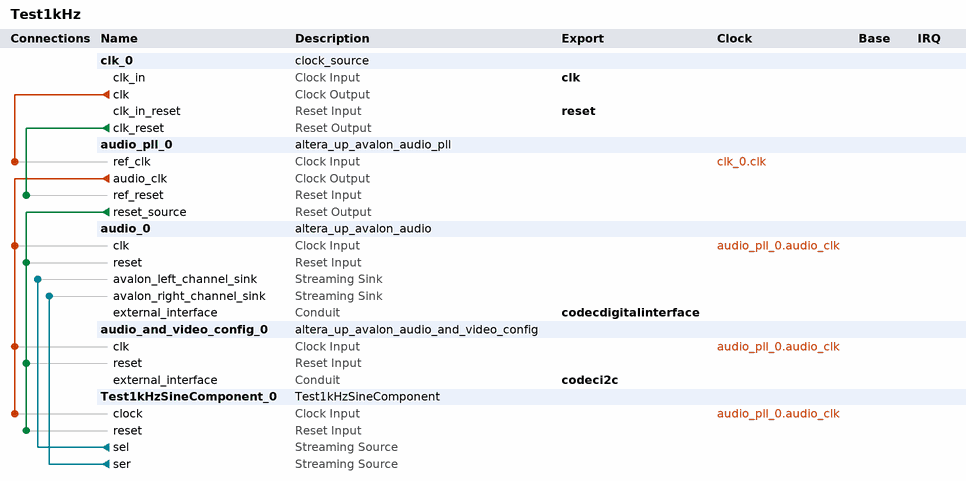
[diagram p0: system contents]
# Platform Designer (Qsys) system Test1kHz, Cyclone V 5CSEMA5F31C6
# Parameters at their usual value, and those the tool derives, are not listed.
package require -exact qsys 17.1
create_system Test1kHz
set_project_property DEVICE_FAMILY {Cyclone V}
set_project_property DEVICE 5CSEMA5F31C6

add_instance clk_0 clock_source 17.1
set_instance_parameter_value clk_0 clockFrequency 50000000

add_instance audio_pll_0 altera_up_avalon_audio_pll 17.1
set_instance_parameter_value audio_pll_0 gui_refclk 50.0

add_instance audio_0 altera_up_avalon_audio 17.1
set_instance_parameter_value audio_0 audio_in false
set_instance_parameter_value audio_0 avalon_bus_type Streaming
set_instance_parameter_value audio_0 dw 24

add_instance audio_and_video_config_0 altera_up_avalon_audio_and_video_config 17.1
set_instance_parameter_value audio_and_video_config_0 audio_in {Microphone to ADC}
set_instance_parameter_value audio_and_video_config_0 bit_length 24
set_instance_parameter_value audio_and_video_config_0 board DE1-SoC
set_instance_parameter_value audio_and_video_config_0 line_in_bypass false
set_instance_parameter_value audio_and_video_config_0 sampling_rate {48 kHz}

add_instance Test1kHzSineComponent_0 Test1kHzSineComponent 1.0
set_instance_parameter_value Test1kHzSineComponent_0 count_freq 48
set_instance_parameter_value Test1kHzSineComponent_0 count_samp 256

# connections
add_connection audio_pll_0.audio_clk audio_0.clk clock
add_connection audio_pll_0.audio_clk audio_and_video_config_0.clk clock
add_connection audio_pll_0.audio_clk Test1kHzSineComponent_0.clock clock
add_connection clk_0.clk audio_pll_0.ref_clk clock
add_connection audio_pll_0.reset_source audio_0.reset reset
add_connection audio_pll_0.reset_source audio_and_video_config_0.reset reset
add_connection audio_pll_0.reset_source Test1kHzSineComponent_0.reset reset
add_connection clk_0.clk_reset audio_pll_0.ref_reset reset
add_connection Test1kHzSineComponent_0.sel audio_0.avalon_left_channel_sink avalon_streaming
add_connection Test1kHzSineComponent_0.ser audio_0.avalon_right_channel_sink avalon_streaming

# exported interfaces
add_interface clk clock sink
set_interface_property clk EXPORT_OF clk_0.clk_in
add_interface codecdigitalinterface conduit end
set_interface_property codecdigitalinterface EXPORT_OF audio_0.external_interface
add_interface codeci2c conduit end
set_interface_property codeci2c EXPORT_OF audio_and_video_config_0.external_interface
add_interface reset reset sink
set_interface_property reset EXPORT_OF clk_0.clk_in_reset

set_interconnect_requirement {$system} qsys_mm.clockCrossingAdapter HANDSHAKE
set_interconnect_requirement {$system} qsys_mm.enableEccProtection FALSE
set_interconnect_requirement {$system} qsys_mm.insertDefaultSlave FALSE
set_interconnect_requirement {$system} qsys_mm.maxAdditionalLatency 1

save_system Test1kHz.qsys
